# Altium schematic sheet demoV1.0.SchDoc
size A3
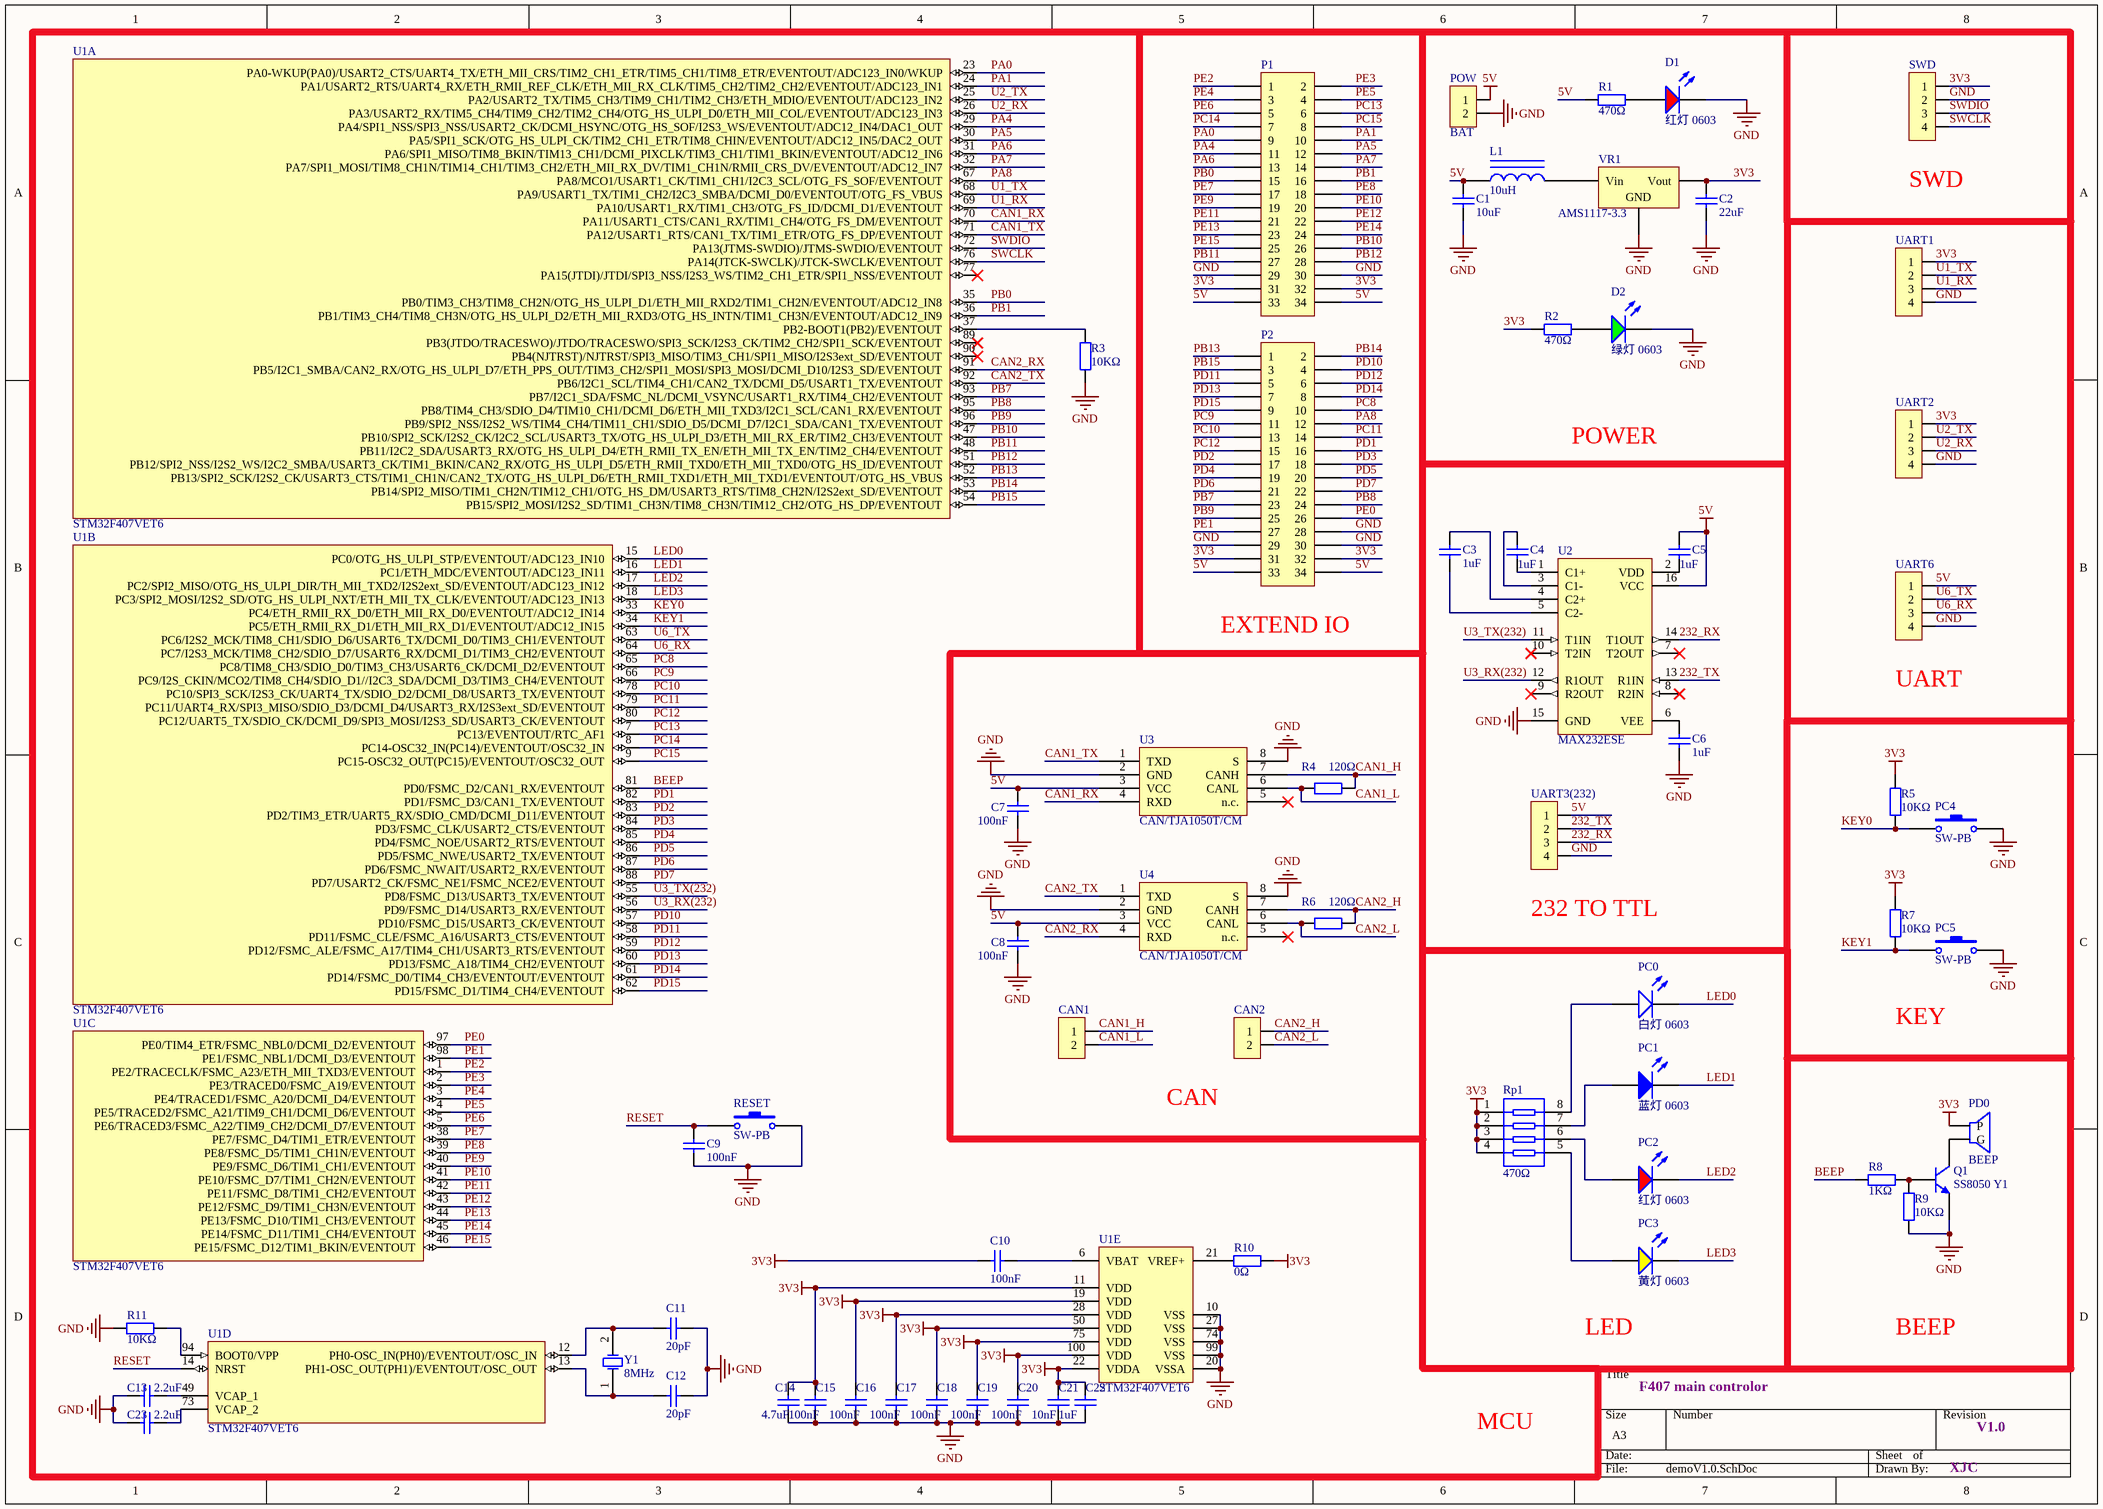
[diagram p0: demoV1.0.SchDoc]

## Parts
C1  10uF  [0603_C]
C2  22uF  [0603_C]
C3  1uF  [0603_C]
C4  1uF  [0603_C]
C5  1uF  [0603_C]
C6  1uF  [0603_C]
C7  100nF  [0603_C]
C8  100nF  [0603_C]
C9  100nF  [0603_C]
C10  100nF  [0603_C]
C11  20pF  [0603_C]
C12  20pF  [0603_C]
C13  2.2uF  [0603_C]
C14  4.7uF  [0603_C]
C15  100nF  [0603_C]
C16  100nF  [0603_C]
C17  100nF  [0603_C]
C18  100nF  [0603_C]
C19  100nF  [0603_C]
C20  100nF  [0603_C]
C21  10nF  [0603_C]
C22  1uF  [0603_C]
C23  2.2uF  [0603_C]
CAN1  CAN  [XH-2]  (value not drawn)
CAN2  CAN  [XH-2]  (value not drawn)
D1  红灯 0603  [0603_LED_S1]
D2  绿灯 0603  [0603_LED_S1]
L1  10uH  [0603_L]
P1  Header 17X2  [HDR2X17]  (value not drawn)
P2  Header 17X2  [HDR2X17]  (value not drawn)
PC0  白灯 0603  [0603_LED_S1]
PC1  蓝灯 0603  [0603_LED_S1]
PC2  红灯 0603  [0603_LED_S1]
PC3  黄灯 0603  [0603_LED_S1]
PC4  SW-PB  [SW_PB2_A1]
PC5  SW-PB  [SW_PB2_A1]
PD0  BEEP  [BELL-5]
POW  BAT  [XH-2]
Q1  SS8050 Y1  [SOT-23(SOT-23-3)]
R1  470Ω  [0603_R]
R2  470Ω  [0603_R]
R3  10KΩ  [0603_R]
R4  120Ω  [0603_R]
R5  10KΩ  [0603_R]
R6  120Ω  [0603_R]
R7  10KΩ  [0603_R]
R8  1KΩ  [0603_R]
R9  10KΩ  [0603_R]
R10  0Ω  [0603_R]
R11  10KΩ  [0603_R]
RESET  SW-PB  [SW_PB2_A1]
Rp1  470Ω  [0603_Rx4]
SWD  SWD  [PH-4]  (value not drawn)
U1  STM32F407VET6  [LQFP-100_14x14x05P]  (parts A,B,C,D,E of 5)
U2  MAX232ESE  [SOIC-16_150mil]
U3  CAN/TJA1050T/CM  [SOIC-8_150mil]
U4  CAN/TJA1050T/CM  [SOIC-8_150mil]
UART1  (no value)  [XH-4]
UART2  (no value)  [XH-4]
UART3(232)  (no value)  [XH-4]
UART6  (no value)  [XH-4]
VR1  AMS1117-3.3  [SOT-223]
Y1  8MHz  [SMD-5032_2P]

## Nets
3V3: C2.2 C10.1 C14.2 C15.2 C16.2 C17.2 C18.2 C19.2 C20.2 C21.2 C22.2 P1.31 P1.32 P2.31 P2.32 PD0.1(P) R2.1 R5.2 R7.2 R10.2 Rp1.1 Rp1.2 Rp1.3 Rp1.4 SWD.1 U1.11(VDD) U1.19(VDD) U1.22(VDDA) U1.28(VDD) U1.50(VDD) U1.75(VDD) U1.100(VDD) UART1.1 UART2.1 VR1.2(Vout)
5V: C1.2 C5.2 C7.2 C8.2 L1.1 P1.33 P1.34 P2.33 P2.34 POW.1 R1.1 U2.16(VCC) U3.3(VCC) U4.3(VCC) UART3(232).1 UART6.1
GND: C1.1 C2.1 C6.2 C7.1 C8.1 C9.1 C11.2 C12.2 C13.1 C14.1 C15.1 C16.1 C17.1 C18.1 C19.1 C20.1 C21.1 C22.1 C23.1 D1.K D2.K P1.29 P1.30 P2.28 P2.29 P2.30 PC4.2 PC5.2 POW.2 Q1.2(E) R3.1 R9.1 R11.1 RESET.2 SWD.2 U1.10(VSS) U1.20(VSSA) U1.27(VSS) U1.74(VSS) U1.99(VSS) U2.15(GND) U3.2(GND) U3.8(S) U4.2(GND) U4.8(S) UART1.4 UART2.4 UART3(232).4 UART6.4 VR1.1(GND)
232_RX: U2.14(T1OUT) UART3(232).3
232_TX: U2.13(R1IN) UART3(232).2
BEEP: R8.1 U1.81(PD0/FSMC_D2/CAN1_RX/EVENTOUT)
CAN1_H: CAN1.1 R4.2 U3.7(CANH)
CAN1_L: CAN1.2 R4.1 U3.6(CANL)
CAN1_RX: U1.70(PA11/USART1_CTS/CAN1_RX/TIM1_CH4/OTG_FS_DM/EVENTOUT) U3.4(RXD)
CAN1_TX: U1.71(PA12/USART1_RTS/CAN1_TX/TIM1_ETR/OTG_FS_DP/EVENTOUT) U3.1(TXD)
CAN2_H: CAN2.1 R6.2 U4.7(CANH)
CAN2_L: CAN2.2 R6.1 U4.6(CANL)
CAN2_RX: U1.91(PB5/I2C1_SMBA/CAN2_RX/OTG_HS_ULPI_D7/ETH_PPS_OUT/TIM3_CH2/SPI1_MOSI/SPI3_MOSI/DCMI_D10/I2S3_SD/EVENTOUT) U4.4(RXD)
CAN2_TX: U1.92(PB6/I2C1_SCL/TIM4_CH1/CAN2_TX/DCMI_D5/USART1_TX/EVENTOUT) U4.1(TXD)
KEY0: PC4.1 R5.1 U1.33(PC4/ETH_RMII_RX_D0/ETH_MII_RX_D0/EVENTOUT/ADC12_IN14)
KEY1: PC5.1 R7.1 U1.34(PC5/ETH_RMII_RX_D1/ETH_MII_RX_D1/EVENTOUT/ADC12_IN15)
LED0: PC0.K U1.15(PC0/OTG_HS_ULPI_STP/EVENTOUT/ADC123_IN10)
LED1: PC1.K U1.16(PC1/ETH_MDC/EVENTOUT/ADC123_IN11)
LED2: PC2.K U1.17(PC2/SPI2_MISO/OTG_HS_ULPI_DIR/TH_MII_TXD2/I2S2ext_SD/EVENTOUT/ADC123_IN12)
LED3: PC3.K U1.18(PC3/SPI2_MOSI/I2S2_SD/OTG_HS_ULPI_NXT/ETH_MII_TX_CLK/EVENTOUT/ADC123_IN13)
PA0: P1.9 U1.23(PA0-WKUP(PA0)/USART2_CTS/UART4_TX/ETH_MII_CRS/TIM2_CH1_ETR/TIM5_CH1/TIM8_ETR/EVENTOUT/ADC123_IN0/WKUP)
PA1: P1.10 U1.24(PA1/USART2_RTS/UART4_RX/ETH_RMII_REF_CLK/ETH_MII_RX_CLK/TIM5_CH2/TIM2_CH2/EVENTOUT/ADC123_IN1)
PA4: P1.11 U1.29(PA4/SPI1_NSS/SPI3_NSS/USART2_CK/DCMI_HSYNC/OTG_HS_SOF/I2S3_WS/EVENTOUT/ADC12_IN4/DAC1_OUT)
PA5: P1.12 U1.30(PA5/SPI1_SCK/OTG_HS_ULPI_CK/TIM2_CH1_ETR/TIM8_CHIN/EVENTOUT/ADC12_IN5/DAC2_OUT)
PA6: P1.13 U1.31(PA6/SPI1_MISO/TIM8_BKIN/TIM13_CH1/DCMI_PIXCLK/TIM3_CH1/TIM1_BKIN/EVENTOUT/ADC12_IN6)
PA7: P1.14 U1.32(PA7/SPI1_MOSI/TIM8_CH1N/TIM14_CH1/TIM3_CH2/ETH_MII_RX_DV/TIM1_CH1N/RMII_CRS_DV/EVENTOUT/ADC12_IN7)
PA8: P2.12 U1.67(PA8/MCO1/USART1_CK/TIM1_CH1/I2C3_SCL/OTG_FS_SOF/EVENTOUT)
PB0: P1.15 U1.35(PB0/TIM3_CH3/TIM8_CH2N/OTG_HS_ULPI_D1/ETH_MII_RXD2/TIM1_CH2N/EVENTOUT/ADC12_IN8)
PB1: P1.16 U1.36(PB1/TIM3_CH4/TIM8_CH3N/OTG_HS_ULPI_D2/ETH_MII_RXD3/OTG_HS_INTN/TIM1_CH3N/EVENTOUT/ADC12_IN9)
PB7: P2.23 U1.93(PB7/I2C1_SDA/FSMC_NL/DCMI_VSYNC/USART1_RX/TIM4_CH2/EVENTOUT)
PB8: P2.24 U1.95(PB8/TIM4_CH3/SDIO_D4/TIM10_CH1/DCMI_D6/ETH_MII_TXD3/I2C1_SCL/CAN1_RX/EVENTOUT)
PB9: P2.25 U1.96(PB9/SPI2_NSS/I2S2_WS/TIM4_CH4/TIM11_CH1/SDIO_D5/DCMI_D7/I2C1_SDA/CAN1_TX/EVENTOUT)
PB10: P1.26 U1.47(PB10/SPI2_SCK/I2S2_CK/I2C2_SCL/USART3_TX/OTG_HS_ULPI_D3/ETH_MII_RX_ER/TIM2_CH3/EVENTOUT)
PB11: P1.27 U1.48(PB11/I2C2_SDA/USART3_RX/OTG_HS_ULPI_D4/ETH_RMII_TX_EN/ETH_MII_TX_EN/TIM2_CH4/EVENTOUT)
PB12: P1.28 U1.51(PB12/SPI2_NSS/I2S2_WS/I2C2_SMBA/USART3_CK/TIM1_BKIN/CAN2_RX/OTG_HS_ULPI_D5/ETH_RMII_TXD0/ETH_MII_TXD0/OTG_HS_ID/EVENTOUT)
PB13: P2.1 U1.52(PB13/SPI2_SCK/I2S2_CK/USART3_CTS/TIM1_CH1N/CAN2_TX/OTG_HS_ULPI_D6/ETH_RMII_TXD1/ETH_MII_TXD1/EVENTOUT/OTG_HS_VBUS)
PB14: P2.2 U1.53(PB14/SPI2_MISO/TIM1_CH2N/TIM12_CH1/OTG_HS_DM/USART3_RTS/TIM8_CH2N/I2S2ext_SD/EVENTOUT)
PB15: P2.3 U1.54(PB15/SPI2_MOSI/I2S2_SD/TIM1_CH3N/TIM8_CH3N/TIM12_CH2/OTG_HS_DP/EVENTOUT)
PC8: P2.10 U1.65(PC8/TIM8_CH3/SDIO_D0/TIM3_CH3/USART6_CK/DCMI_D2/EVENTOUT)
PC9: P2.11 U1.66(PC9/I2S_CKIN/MCO2/TIM8_CH4/SDIO_D1//I2C3_SDA/DCMI_D3/TIM3_CH4/EVENTOUT)
PC10: P2.13 U1.78(PC10/SPI3_SCK/I2S3_CK/UART4_TX/SDIO_D2/DCMI_D8/USART3_TX/EVENTOUT)
PC11: P2.14 U1.79(PC11/UART4_RX/SPI3_MISO/SDIO_D3/DCMI_D4/USART3_RX/I2S3ext_SD/EVENTOUT)
PC12: P2.15 U1.80(PC12/UART5_TX/SDIO_CK/DCMI_D9/SPI3_MOSI/I2S3_SD/USART3_CK/EVENTOUT)
PC13: P1.6 U1.7(PC13/EVENTOUT/RTC_AF1)
PC14: P1.7 U1.8(PC14-OSC32_IN(PC14)/EVENTOUT/OSC32_IN)
PC15: P1.8 U1.9(PC15-OSC32_OUT(PC15)/EVENTOUT/OSC32_OUT)
PD1: P2.16 U1.82(PD1/FSMC_D3/CAN1_TX/EVENTOUT)
PD2: P2.17 U1.83(PD2/TIM3_ETR/UART5_RX/SDIO_CMD/DCMI_D11/EVENTOUT)
PD3: P2.18 U1.84(PD3/FSMC_CLK/USART2_CTS/EVENTOUT)
PD4: P2.19 U1.85(PD4/FSMC_NOE/USART2_RTS/EVENTOUT)
PD5: P2.20 U1.86(PD5/FSMC_NWE/USART2_TX/EVENTOUT)
PD6: P2.21 U1.87(PD6/FSMC_NWAIT/USART2_RX/EVENTOUT)
PD7: P2.22 U1.88(PD7/USART2_CK/FSMC_NE1/FSMC_NCE2/EVENTOUT)
PD10: P2.4 U1.57(PD10/FSMC_D15/USART3_CK/EVENTOUT)
PD11: P2.5 U1.58(PD11/FSMC_CLE/FSMC_A16/USART3_CTS/EVENTOUT)
PD12: P2.6 U1.59(PD12/FSMC_ALE/FSMC_A17/TIM4_CH1/USART3_RTS/EVENTOUT)
PD13: P2.7 U1.60(PD13/FSMC_A18/TIM4_CH2/EVENTOUT)
PD14: P2.8 U1.61(PD14/FSMC_D0/TIM4_CH3/EVENTOUT/EVENTOUT)
PD15: P2.9 U1.62(PD15/FSMC_D1/TIM4_CH4/EVENTOUT)
PE0: P2.26 U1.97(PE0/TIM4_ETR/FSMC_NBL0/DCMI_D2/EVENTOUT)
PE1: P2.27 U1.98(PE1/FSMC_NBL1/DCMI_D3/EVENTOUT)
PE2: P1.1 U1.1(PE2/TRACECLK/FSMC_A23/ETH_MII_TXD3/EVENTOUT)
PE3: P1.2 U1.2(PE3/TRACED0/FSMC_A19/EVENTOUT)
PE4: P1.3 U1.3(PE4/TRACED1/FSMC_A20/DCMI_D4/EVENTOUT)
PE5: P1.4 U1.4(PE5/TRACED2/FSMC_A21/TIM9_CH1/DCMI_D6/EVENTOUT)
PE6: P1.5 U1.5(PE6/TRACED3/FSMC_A22/TIM9_CH2/DCMI_D7/EVENTOUT)
PE7: P1.17 U1.38(PE7/FSMC_D4/TIM1_ETR/EVENTOUT)
PE8: P1.18 U1.39(PE8/FSMC_D5/TIM1_CH1N/EVENTOUT)
PE9: P1.19 U1.40(PE9/FSMC_D6/TIM1_CH1/EVENTOUT)
PE10: P1.20 U1.41(PE10/FSMC_D7/TIM1_CH2N/EVENTOUT)
PE11: P1.21 U1.42(PE11/FSMC_D8/TIM1_CH2/EVENTOUT)
PE12: P1.22 U1.43(PE12/FSMC_D9/TIM1_CH3N/EVENTOUT)
PE13: P1.23 U1.44(PE13/FSMC_D10/TIM1_CH3/EVENTOUT)
PE14: P1.24 U1.45(PE14/FSMC_D11/TIM1_CH4/EVENTOUT)
PE15: P1.25 U1.46(PE15/FSMC_D12/TIM1_BKIN/EVENTOUT)
RESET: C9.2 RESET.1 U1.14(NRST)
SWCLK: SWD.4 U1.76(PA14(JTCK-SWCLK)/JTCK-SWCLK/EVENTOUT)
SWDIO: SWD.3 U1.72(PA13(JTMS-SWDIO)/JTMS-SWDIO/EVENTOUT)
U1_RX: U1.69(PA10/USART1_RX/TIM1_CH3/OTG_FS_ID/DCMI_D1/EVENTOUT) UART1.3
U1_TX: U1.68(PA9/USART1_TX/TIM1_CH2/I2C3_SMBA/DCMI_D0/EVENTOUT/OTG_FS_VBUS) UART1.2
U2_RX: U1.26(PA3/USART2_RX/TIM5_CH4/TIM9_CH2/TIM2_CH4/OTG_HS_ULPI_D0/ETH_MII_COL/EVENTOUT/ADC123_IN3) UART2.3
U2_TX: U1.25(PA2/USART2_TX/TIM5_CH3/TIM9_CH1/TIM2_CH3/ETH_MDIO/EVENTOUT/ADC123_IN2) UART2.2
U3_RX(232): U1.56(PD9/FSMC_D14/USART3_RX/EVENTOUT) U2.12(R1OUT)
U3_TX(232): U1.55(PD8/FSMC_D13/USART3_TX/EVENTOUT) U2.11(T1IN)
U6_RX: U1.64(PC7/I2S3_MCK/TIM8_CH2/SDIO_D7/USART6_RX/DCMI_D1/TIM3_CH2/EVENTOUT) UART6.3
U6_TX: U1.63(PC6/I2S2_MCK/TIM8_CH1/SDIO_D6/USART6_TX/DCMI_D0/TIM3_CH1/EVENTOUT) UART6.2
NetC3_1: C3.1 U2.5(C2-)
NetC3_2: C3.2 U2.4(C2+)
NetC4_1: C4.1 U2.1(C1+)
NetC4_2: C4.2 U2.3(C1-)
NetC5_1: C5.1 U2.2(VDD)
NetC6_1: C6.1 U2.6(VEE)
NetC10_2: C10.2 U1.6(VBAT)
NetC11_1: C11.1 U1.12(PH0-OSC_IN(PH0)/EVENTOUT/OSC_IN) Y1.2(OSC2)
NetC12_1: C12.1 U1.13(PH1-OSC_OUT(PH1)/EVENTOUT/OSC_OUT) Y1.1(OSC1)
NetC13_2: C13.2 U1.49(VCAP_1)
NetC23_2: C23.2 U1.73(VCAP_2)
NetD1_A: D1.A R1.2
NetD2_A: D2.A R2.2
NetL1_2: L1.2 VR1.3(Vin)
NetPC0_A: PC0.A Rp1.8
NetPC1_A: PC1.A Rp1.7
NetPC2_A: PC2.A Rp1.6
NetPC3_A: PC3.A Rp1.5
NetPD0_2: PD0.2(G) Q1.3(C)
NetQ1_1: Q1.1(B) R8.2 R9.2
NetR3_2: R3.2 U1.37(PB2-BOOT1(PB2)/EVENTOUT)
NetR10_1: R10.1 U1.21(VREF+)
NetR11_2: R11.2 U1.94(BOOT0/VPP)

Not connected (* = marked no-connect by the designer): U1 77(PA15(JTDI)/JTDI/SPI3_NSS/I2S3_WS/TIM2_CH1_ETR/SPI1_NSS/EVENTOUT)* 89(PB3(JTDO/TRACESWO)/JTDO/TRACESWO/SPI3_SCK/I2S3_CK/TIM2_CH2/SPI1_SCK/EVENTOUT)* 90(PB4(NJTRST)/NJTRST/SPI3_MISO/TIM3_CH1/SPI1_MISO/I2S3ext_SD/EVENTOUT)*; U2 7(T2OUT)* 8(R2IN)* 9(R2OUT)* 10(T2IN)*; U3 5(n.c.)*; U4 5(n.c.)*

## Notes on the sheet
- (near SWD) SWD
- POWER
- (near P2) EXTEND IO
- (near UART6) UART
- (near UART3(232)) 232 TO TTL
- KEY
- CAN
- LED
- F407 main controlor
- BEEP
- MCU
- V1.0
- XJC

## Library data of the parts
C1 = 0603 10uF (106) 10% 10V: 贴片电容; ComponentLink1Description: 供应商链接; ComponentLink1URL: http://www.szlcsc.com/product/details_20411.html; Package: 0603; Supplier: LC; SuppliersPartNumber: C19702
C2 = 0603 22uF (226) 20% 6.3V: 贴片电容; ComponentLink1Description: 供应商链接; ComponentLink1URL: http://www.szlcsc.com/product/details_60514.html; Package: 0603; Supplier: LC; SuppliersPartNumber: C59461
C3-C6 C22 = 0603 1uF (105) 10% 50V: 贴片电容; ComponentLink1Description: 供应商链接; ComponentLink1URL: http://www.szlcsc.com/product/details_16531.html; Package: 0603; Supplier: LC; SuppliersPartNumber: C15849
C7-C10 C15-C20 = 0603 100nF (104) 10% 50V: 贴片电容; ComponentLink1Description: 供应商链接; ComponentLink1URL: http://www.szlcsc.com/product/details_15331.html; Package: 0603; Supplier: LC; SuppliersPartNumber: C14663
C11 C12 = 0603 20pF (200) 5% 50V: 贴片电容; ComponentLink1Description: 供应商链接; ComponentLink1URL: http://www.szlcsc.com/product/details_2000.html; Package: 0603; Supplier: LC; SuppliersPartNumber: C1648
C13 C23 = 0603 2.2uF (225) 10% 16V: 贴片电容; ComponentLink1Description: 供应商链接; ComponentLink1URL: http://www.szlcsc.com/product/details_24366.html; Package: 0603; Supplier: LC; SuppliersPartNumber: C23630
C14 = 0603 4.7uF (475) 10% 16V: 贴片电容; ComponentLink1Description: 供应商链接; ComponentLink1URL: http://www.szlcsc.com/product/details_20375.html; Package: 0603; Supplier: LC; SuppliersPartNumber: C19666
C21 = 0603 10nF (103) 10% 50V: 贴片电容; ComponentLink1Description: 供应商链接; ComponentLink1URL: http://www.szlcsc.com/product/details_58143.html; Package: 0603; Supplier: LC; SuppliersPartNumber: C57112
CAN1 CAN2 POW = CON2: Connector
D1 PC2 = 0603 红灯: 发光二极管; ComponentLink1Description: 供应商链接; ComponentLink1URL: http://www.szlcsc.com/product/details_2659.html; Package: 0603; Supplier: LC; SuppliersPartNumber: C2286
D2 = 0603 绿灯: 发光二极管; ComponentLink1Description: 供应商链接; ComponentLink1URL: http://www.szlcsc.com/product/details_73152.html; Package: 0603; Supplier: LC; SuppliersPartNumber: C72043
L1 = 0603 10uH 10%: 贴片电感; ComponentLink1Description: 供应商链接; ComponentLink1URL: http://www.szlcsc.com/product/details_1387.html; Package: 0603; Supplier: LC; SuppliersPartNumber: C1035
P1 P2 = Header 17X2: Header, 17-Pin, Dual row; LatestRevisionDate: 17-Jul-2002; LatestRevisionNote: Re-released for DXP Platform.; Publisher: Altium Limited
PC0 = 0603 白灯: 发光二极管; ComponentLink1Description: 供应商链接; ComponentLink1URL: http://www.szlcsc.com/product/details_2663.html; Package: 0603; Supplier: LC; SuppliersPartNumber: C2290
PC1 = 0603 蓝灯: 发光二极管; ComponentLink1Description: 供应商链接; ComponentLink1URL: http://www.szlcsc.com/product/details_73150.html; Package: 0603; Supplier: LC; SuppliersPartNumber: C72041
PC3 = 0603 黄灯: 发光二极管; ComponentLink1Description: 供应商链接; ComponentLink1URL: http://www.szlcsc.com/product/details_73147.html; Package: 0603; Supplier: LC; SuppliersPartNumber: C72038
PC4 PC5 RESET = SW-PB: 微动开关; Published: 24-Mar-1999; LatestRevisionDate: 17-Jul-2002; LatestRevisionNote: Re-released for DXP Platform.; PackageReference: SPST-2; Publisher: Altium Limited
Q1 = SOT-23 SS8050 Y1: 三极管; ComponentLink1Description: 供应商链接; ComponentLink1URL: http://www.szlcsc.com/product/details_2507.html; Package: SOT-23; Supplier: LC; SuppliersPartNumber: C2150
R1 R2 = 0603 470Ω (4700) 1%: 贴片电阻; ComponentLink1Description: 供应商链接; ComponentLink1URL: http://www.szlcsc.com/product/details_23906.html; Package: 0603; Supplier: LC; SuppliersPartNumber: C23179
R3 R5 R7 R9 R11 = 0603 10KΩ (1002) 1%: 贴片电阻; ComponentLink1Description: 供应商链接; ComponentLink1URL: http://www.szlcsc.com/product/details_26547.html; Package: 0603; Supplier: LC; SuppliersPartNumber: C25804
R4 R6 = 0603 120Ω (1200) 1%: 贴片电阻; ComponentLink1Description: 供应商链接; ComponentLink1URL: http://www.szlcsc.com/product/details_23514.html; Package: 0603; Supplier: LC; SuppliersPartNumber: C22787
R8 = 0603 1KΩ (1001) 1%: 贴片电阻; ComponentLink1Description: 供应商链接; ComponentLink1URL: http://www.szlcsc.com/product/details_21904.html; Package: 0603; Supplier: LC; SuppliersPartNumber: C21190
R10 = 0603 0Ω (0R0) 1%: 贴片电阻; ComponentLink1Description: 供应商链接; ComponentLink1URL: http://www.szlcsc.com/product/details_21903.html; Package: 0603; Supplier: LC; SuppliersPartNumber: C21189
Rp1 = 0603*4 470Ω (471) 5%: 贴片排阻; ComponentLink1Description: 供应商链接; ComponentLink1URL: http://www.szlcsc.com/product/details_26253.html; Package: 0603*4; Supplier: LC; SuppliersPartNumber: C25510
SWD UART1 UART2 UART3(232) UART6 = CON4: Connector
U1 = STM32F407VET6: ARM; ComponentLink1Description: 供应商链接; ComponentLink1URL: http://www.szlcsc.com/product/details_29482.html; Package: LQFP-100_14x14x05P; Supplier: LC; SuppliersPartNumber: C28730
U2 = MAX232ESE_[C26860]: RS232; ComponentLink1Description: 供应商链接; ComponentLink1URL: http://www.szlcsc.com/product/details_27608.html; Package: SOIC-16_150mil; Supplier: LC; SuppliersPartNumber: C26860
U3 U4 = CAN/TJA1050T/CM_[C6952]: CAN; ComponentLink1Description: 供应商链接; ComponentLink1URL: http://www.szlcsc.com/product/details_7424.html; Package: SOIC-8_150mil; Supplier: LC; SuppliersPartNumber: C6952
VR1 = SOT-223 AMS1117-3.3: 低压差线性稳压(LDO); ComponentLink1Description: 供应商链接; ComponentLink1URL: http://www.szlcsc.com/product/details_6652.html; Package: SOT-223; Supplier: LC; SuppliersPartNumber: C6186
Y1 = SMD-5032_2P 8MHz 20ppm 20pF: 贴片晶振; ComponentLink1Description: 供应商链接; ComponentLink1URL: http://www.szlcsc.com/product/details_117214.html; Package: SMD-5032_2P; Supplier: LC; SuppliersPartNumber: C115962